# Altium schematic sheet [03] - WIRELESS MCU,CONTROLS.SchDoc
size A3; DocumentNumber: 3; SheetNumber: 3; SheetTotal: 8
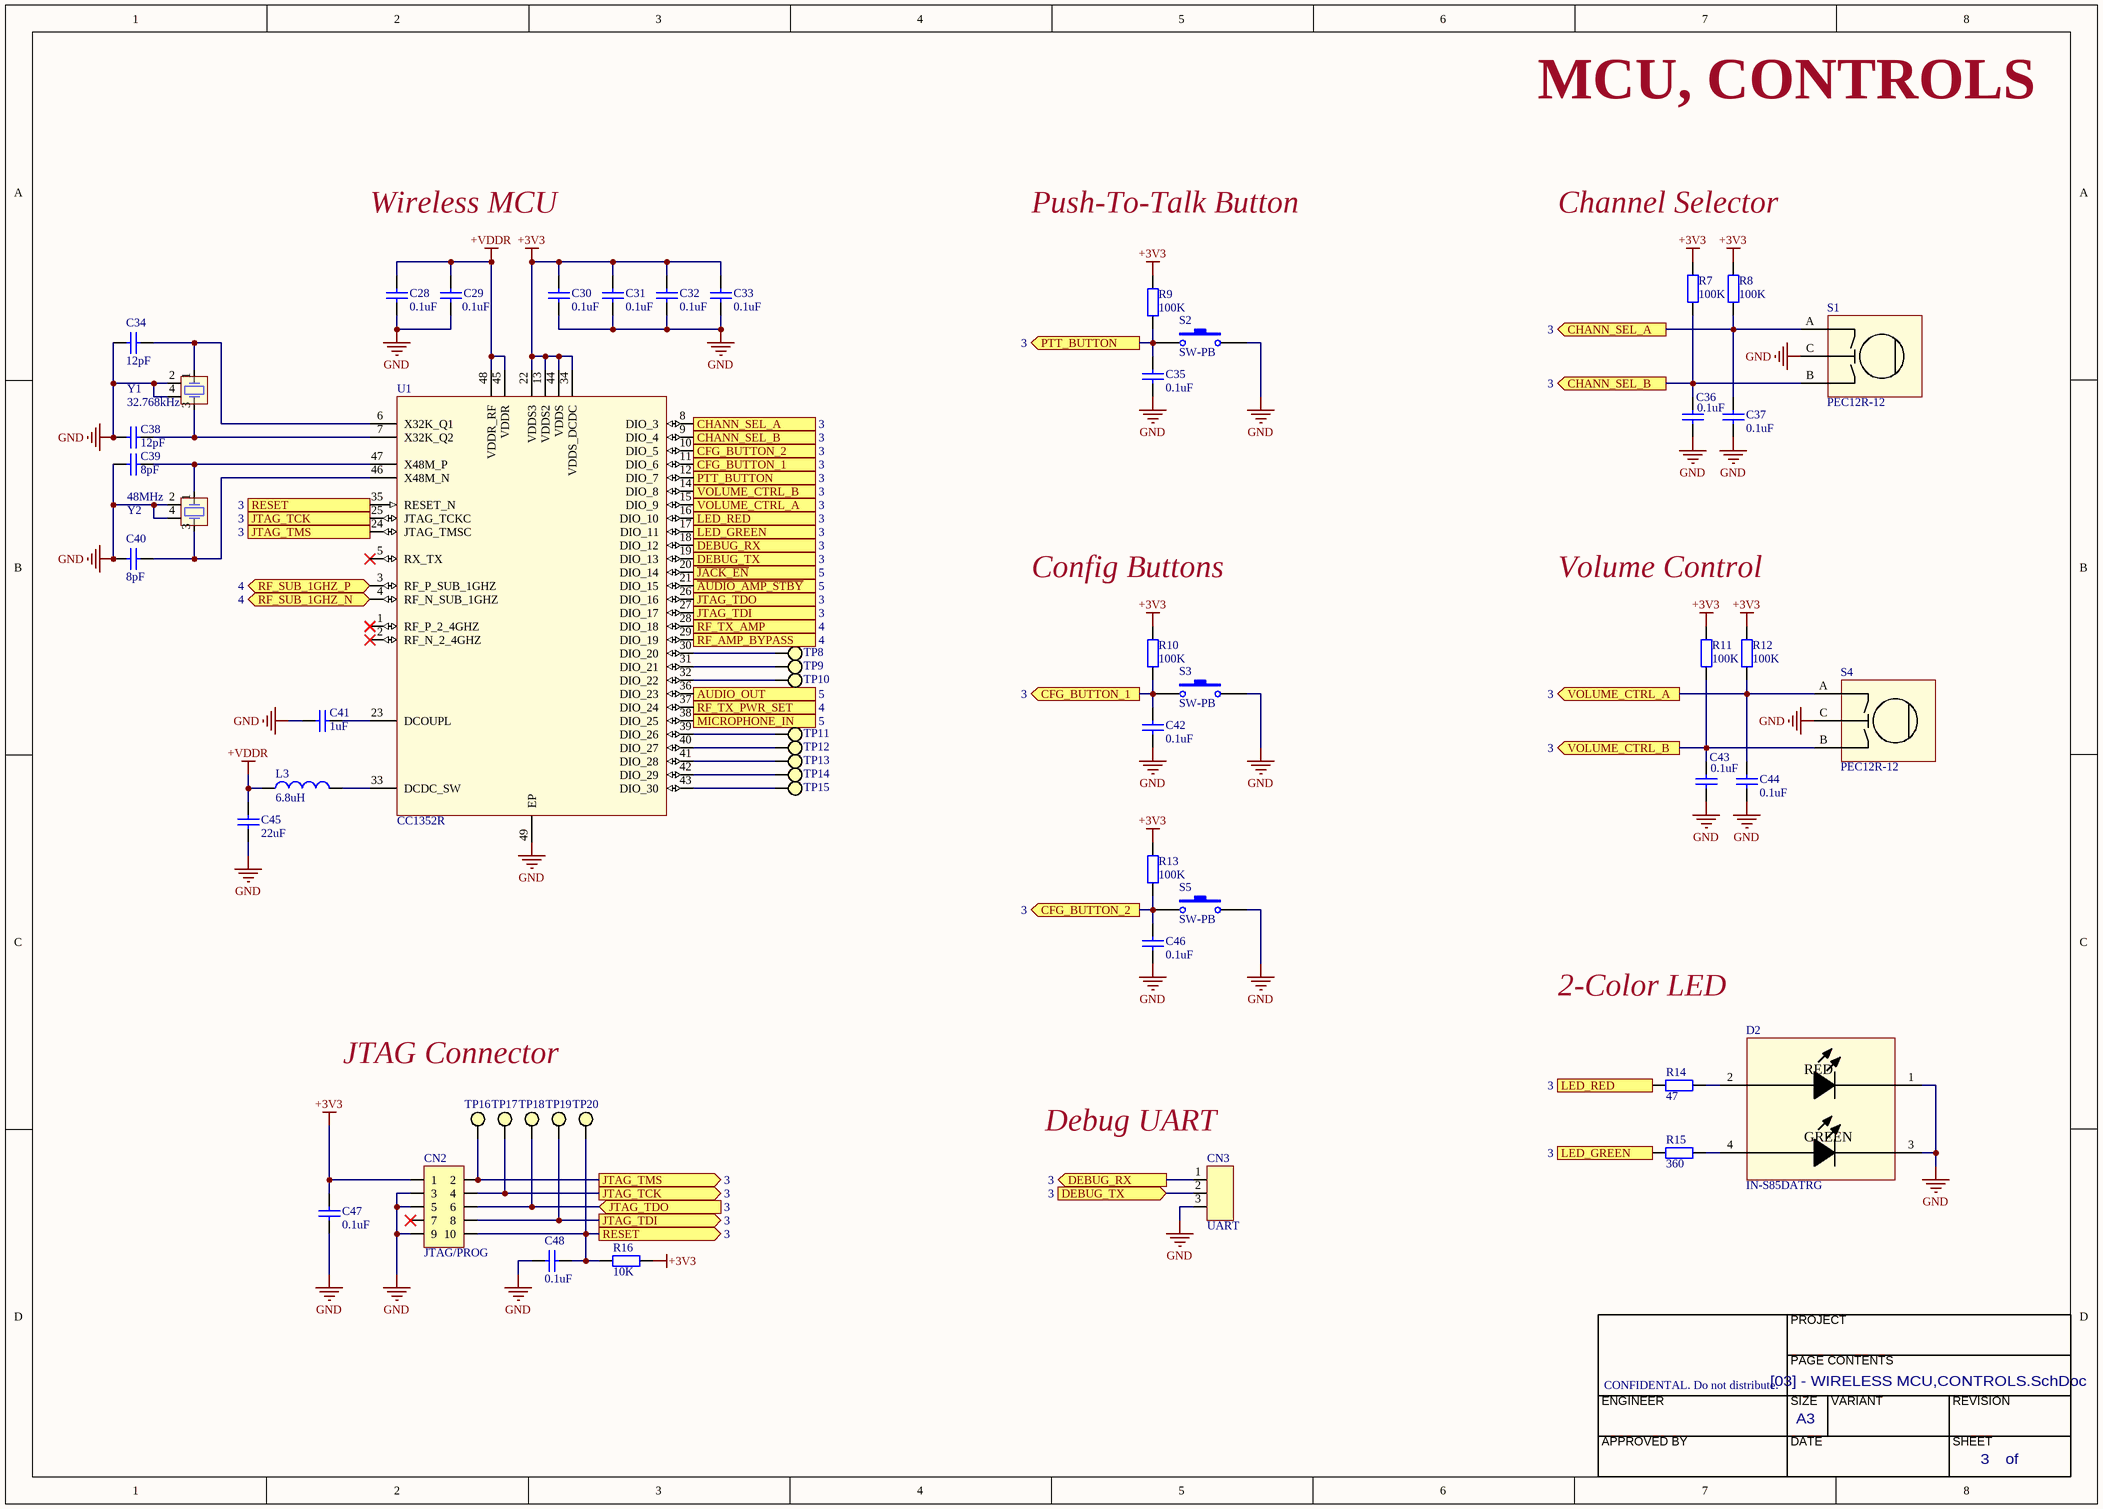
[diagram p0: [03] - WIRELESS MCU,CONTROLS.SchDoc]

## Parts
C28  0.1uF  [CAP0603]
C29  0.1uF  [CAP0603]
C30  0.1uF  [CAP0603]
C31  0.1uF  [CAP0603]
C32  0.1uF  [CAP0603]
C33  0.1uF  [CAP0603]
C34  12pF  [CAP0603]
C35  0.1uF  [CAP0603]
C36  0.1uF  [CAP0603]
C37  0.1uF  [CAP0603]
C38  12pF  [CAP0603]
C39  8pF  [CAP0603]
C40  8pF  [CAP0603]
C41  1uF  [CAP0603]
C42  0.1uF  [CAP0603]
C43  0.1uF  [CAP0603]
C44  0.1uF  [CAP0603]
C45  22uF  [CAP0603]
C46  0.1uF  [CAP0603]
C47  0.1uF  [CAP0603]
C48  0.1uF  [CAP0603]
CN2  JTAG/PROG  [CONN_3220-10-0100-00]
CN3  UART  [H-D-1x3]
D2  IN-S85DATRG  [INS128DATRG]
L3  6.8uH  [INDC0603-0201]
R7  100K  [RES0603]
R8  100K  [RES0603]
R9  100K  [RES0603]
R10  100K  [RES0603]
R11  100K  [RES0603]
R12  100K  [RES0603]
R13  100K  [RES0603]
R14  47  [RES0603]
R15  360  [RES0603]
R16  10K  [RES0603]
S1  PEC12R-12
S2  SW-PB  [ButtonSmall]
S3  SW-PB  [ButtonSmall]
S4  PEC12R-12
S5  SW-PB  [ButtonSmall]
TP8  TestPoint  [TestPoint]  (value not drawn)  (no BOM)
TP9  TestPoint  [TestPoint]  (value not drawn)  (no BOM)
TP10  TestPoint  [TestPoint]  (value not drawn)  (no BOM)
TP11  TestPoint  [TestPoint]  (value not drawn)  (no BOM)
TP12  TestPoint  [TestPoint]  (value not drawn)  (no BOM)
TP13  TestPoint  [TestPoint]  (value not drawn)  (no BOM)
TP14  TestPoint  [TestPoint]  (value not drawn)  (no BOM)
TP15  TestPoint  [TestPoint]  (value not drawn)  (no BOM)
TP16  TestPoint  [TestPoint]  (value not drawn)  (no BOM)
TP17  TestPoint  [TestPoint]  (value not drawn)  (no BOM)
TP18  TestPoint  [TestPoint]  (value not drawn)  (no BOM)
TP19  TestPoint  [TestPoint]  (value not drawn)  (no BOM)
TP20  TestPoint  [TestPoint]  (value not drawn)  (no BOM)
U1  CC1352R  [RGZ0048A]
Y1  32.768kHz  [ABM3B]
Y2  48MHz  [ABM3B]

## Ports
AUDIO_OUT (out, see 5), CFG_BUTTON_1 (in, see 3), CFG_BUTTON_1 (out, see 3), CFG_BUTTON_2 (in, see 3), CFG_BUTTON_2 (out, see 3), CHANN_SEL_A (in, see 3), CHANN_SEL_A (out, see 3), CHANN_SEL_B (in, see 3), CHANN_SEL_B (out, see 3), DEBUG_RX (in, see 3), DEBUG_RX (out, see 3), DEBUG_TX (in, see 3), DEBUG_TX (out, see 3), JTAG_TCK (in, see 3), JTAG_TCK (out, see 3), JTAG_TDI (in, see 3), JTAG_TDI (out, see 3), JTAG_TDO (in, see 3), JTAG_TDO (out, see 3), JTAG_TMS (in, see 3), JTAG_TMS (out, see 3), LED_GREEN (in, see 3), LED_GREEN (out, see 3), LED_RED (in, see 3), LED_RED (out, see 3), MICROPHONE_IN (in, see 5), PTT_BUTTON (in, see 3), PTT_BUTTON (out, see 3), RESET (in, see 3), RESET (out, see 3), RF_AMP_BYPASS (out, see 4), RF_SUB_1GHZ_N (bidir, see 4), RF_SUB_1GHZ_P (bidir, see 4), RF_TX_AMP (out, see 4), RF_TX_PWR_SET (out, see 4), VOLUME_CTRL_A (in, see 3), VOLUME_CTRL_A (out, see 3), VOLUME_CTRL_B (in, see 3), VOLUME_CTRL_B (out, see 3), ~{AUDIO_AMP_STBY} (out, see 5), ~{JACK_EN} (in, see 5)

## Nets
+3V3: C30.1 C31.1 C32.1 C33.1 C47.2 CN2.1 R7.1 R8.2 R9.1 R10.1 R11.1 R12.2 R13.1 R16.2 U1.13(VDDS2) U1.22(VDDS3) U1.34(VDDS_DCDC) U1.44(VDDS)
+VDDR: C28.1 C29.1 C45.2 L3.1 U1.45(VDDR) U1.48(VDDR_RF)
GND: C28.2 C29.2 C30.2 C31.2 C32.2 C33.2 C34.1 C35.1 C36.1 C37.1 C38.1 C39.1 C40.1 C41.2 C42.1 C43.1 C44.1 C45.1 C46.1 C47.1 C48.1 CN2.3 CN2.5 CN2.9 CN3.3 D2.1(C_R) D2.3(C_G) S1.C S2.2 S3.2 S4.C S5.2 U1.49(EP) Y1.2(GND) Y1.4(GND) Y2.2(GND) Y2.4(GND)
~{AUDIO_AMP_STBY}: U1.21(DIO_15) ; port ~{AUDIO_AMP_STBY}
AUDIO_OUT: U1.36(DIO_23) ; port AUDIO_OUT
CFG_BUTTON_1: C42.2 R10.2 S3.1 U1.11(DIO_6) ; port CFG_BUTTON_1
CFG_BUTTON_2: C46.2 R13.2 S5.1 U1.10(DIO_5) ; port CFG_BUTTON_2
CHANN_SEL_A: C37.2 R8.1 S1.A U1.8(DIO_3) ; port CHANN_SEL_A
CHANN_SEL_B: C36.2 R7.2 S1.B U1.9(DIO_4) ; port CHANN_SEL_B
DEBUG_RX: CN3.1 U1.18(DIO_12) ; port DEBUG_RX
DEBUG_TX: CN3.2 U1.19(DIO_13) ; port DEBUG_TX
~{JACK_EN}: U1.20(DIO_14) ; port ~{JACK_EN}
JTAG_TCK: CN2.4 TP17.1 U1.25(JTAG_TCKC) ; port JTAG_TCK
JTAG_TDI: CN2.8 TP19.1 U1.27(DIO_17) ; port JTAG_TDI
JTAG_TDO: CN2.6 TP18.1 U1.26(DIO_16) ; port JTAG_TDO
JTAG_TMS: CN2.2 TP16.1 U1.24(JTAG_TMSC) ; port JTAG_TMS
LED_GREEN: R15.2 U1.17(DIO_11) ; port LED_GREEN
LED_RED: R14.1 U1.16(DIO_10) ; port LED_RED
MICROPHONE_IN: U1.38(DIO_25) ; port MICROPHONE_IN
PTT_BUTTON: C35.2 R9.2 S2.1 U1.12(DIO_7) ; port PTT_BUTTON
RESET: C48.2 CN2.10 R16.1 TP20.1 U1.35(RESET_N) ; port RESET
RF_AMP_BYPASS: U1.29(DIO_19) ; port RF_AMP_BYPASS
RF_SUB_1GHZ_N: U1.4(RF_N_SUB_1GHZ) ; port RF_SUB_1GHZ_N
RF_SUB_1GHZ_P: U1.3(RF_P_SUB_1GHZ) ; port RF_SUB_1GHZ_P
RF_TX_AMP: U1.28(DIO_18) ; port RF_TX_AMP
RF_TX_PWR_SET: U1.37(DIO_24) ; port RF_TX_PWR_SET
VOLUME_CTRL_A: C44.2 R12.1 S4.A U1.15(DIO_9) ; port VOLUME_CTRL_A
VOLUME_CTRL_B: C43.2 R11.2 S4.B U1.14(DIO_8) ; port VOLUME_CTRL_B
NetC34_2: C34.2 U1.6(X32K_Q1) Y1.1(OSC1)
NetC38_2: C38.2 U1.7(X32K_Q2) Y1.3(OSC2)
NetC39_2: C39.2 U1.47(X48M_P) Y2.1(OSC1)
NetC40_2: C40.2 U1.46(X48M_N) Y2.3(OSC2)
NetC41_1: C41.1 U1.23(DCOUPL)
NetD2_2: D2.2(A_R) R14.2
NetD2_4: D2.4(A_G) R15.1
NetL3_2: L3.2 U1.33(DCDC_SW)
NetTP8_1: TP8.1 U1.30(DIO_20)
NetTP9_1: TP9.1 U1.31(DIO_21)
NetTP10_1: TP10.1 U1.32(DIO_22)
NetTP11_1: TP11.1 U1.39(DIO_26)
NetTP12_1: TP12.1 U1.40(DIO_27)
NetTP13_1: TP13.1 U1.41(DIO_28)
NetTP14_1: TP14.1 U1.42(DIO_29)
NetTP15_1: TP15.1 U1.43(DIO_30)

Not connected (* = marked no-connect by the designer): CN2 7*; U1 1(RF_P_2_4GHZ)* 2(RF_N_2_4GHZ)* 5(RX_TX)*

## Notes on the sheet
- MCU, CONTROLS
- Wireless MCU
- Push-To-Talk Button
- Channel Selector
- Config Buttons
- Volume Control
- 2-Color LED
- JTAG Connector
- (near CN3) Debug UART
- PROJECT
- CONFIDENTAL. Do not distribute.
- PAGE CONTENTS
- ENGINEER
- APPROVED BY
- SIZE
- DATE
- A3
- VARIANT
- REVISION
- SHEET
- of
- (in symbol IN-S85DATRG) RED; GREEN

## Library data of the parts
C28-C33 = Cap: Capacitor; Manufacturer: KEMET; Manufacturer Part Number: C0603C104M5RACTU; Description 1: Cap Ceramic 0.1uF 50V X7R 20% SMD 0603 125C T/R; Dielectric Material: Ceramic; Capacitance: 100nF; Tolerance: 20%; Voltage Rating: 50V; Dielectric: X7R; Dissipation Factor: 2.5%; ComponentLink1URL: https://datasheet.ciiva.com/5999/1732731-5999390.pdf?src-supplier=Farnell; ComponentLink1Description: https://datasheet.ciiva.com/5999/1732731-5999390.pdf?src-supplier=Farnell; ComponentLink2URL: https://datasheet.ciiva.com/28645/1851736-28645613.pdf?src-supplier=Element14; ComponentLink2Description: https://datasheet.ciiva.com/28645/1851736-28645613.pdf?src-supplier=Element14; ComponentLink3URL: https://datasheet.ciiva.com/7823/kem-c1002-x7r-smd-7823982.pdf?src-supplier=Element14; ComponentLink3Description: https://datasheet.ciiva.com/7823/kem-c1002-x7r-smd-7823982.pdf?src-supplier=Element14; ComponentLink4URL: http://datasheet.octopart.com/C0603C104J4RACTU-KEMET-datasheet-137357764.pdf?src-supplier=Upverter; ComponentLink4Description: http://datasheet.octopart.com/C0603C104J4RACTU-KEMET-datasheet-137357764.pdf?src-supplier=Upverter; ComponentLink5URL: http://datasheet.octopart.com/C0603C104J4RAC-TU-Kemet-datasheet-5313890.pdf?src-supplier=Farnell; ComponentLink5Description: http://datasheet.octopart.com/C0603C104J4RAC-TU-Kemet-datasheet-5313890.pdf?src-supplier=Farnell; ComponentLink6URL: http://datasheet.octopart.com/C0603C104J4RACTU-Kemet-datasheet-10404442.pdf?src-supplier=Farnell; ComponentLink6Description: http://datasheet.octopart.com/C0603C104J4RACTU-Kemet-datasheet-10404442.pdf?src-supplier=Farnell; ComponentLink7URL: http://datasheet.octopart.com/C0603C104J4RACTU-Kemet-datasheet-10942409.pdf?src-supplier=Farnell; ComponentLink7Description: http://datasheet.octopart.com/C0603C104J4RACTU-Kemet-datasheet-10942409.pdf?src-supplier=Farnell; ComponentLink8URL: http://datasheet.octopart.com/C0603C104J4RACTU-Kemet-datasheet-11992184.pdf?src-supplier=Farnell; ComponentLink8Description: http://datasheet.octopart.com/C0603C104J4RACTU-Kemet-datasheet-11992184.pdf?src-supplier=Farnell; ComponentLink9URL: http://datasheet.octopart.com/C0603C104J4RACTU-Kemet-datasheet-12608295.pdf?src-supplier=Farnell; ComponentLink9Description: http://datasheet.octopart.com/C0603C104J4RACTU-Kemet-datasheet-12608295.pdf?src-supplier=Farnell; ComponentLink10URL: http://datasheet.octopart.com/C0603C104J4RACTU-KEMET-datasheet-101575649.pdf?src-supplier=Farnell; ComponentLink10Description: http://datasheet.octopart.com/C0603C104J4RACTU-KEMET-datasheet-101575649.pdf?src-supplier=Farnell; ComponentLink11URL: http://datasheet.octopart.com/C0603C104J4RACTU-Kemet-datasheet-464.pdf?src-supplier=Allied+Electronics; ComponentLink11Description: http://datasheet.octopart.com/C0603C104J4RACTU-Kemet-datasheet-464.pdf?src-supplier=Allied+Electronics; ComponentLink12URL: http://datasheet.octopart.com/C0603C104J4RAC-TU-Kemet-datasheet-8216256.pdf?src-supplier=Jameco; ComponentLink12Description: http://datasheet.octopart.com/C0603C104J4RAC-TU-Kemet-datasheet-8216256.pdf?src-supplier=Jameco; ComponentLink13URL: http://datasheet.octopart.com/C0603C104J4RAC-TU-Kemet-datasheet-5313836.pdf?src-supplier=Farnell; ComponentLink13Description: http://datasheet.octopart.com/C0603C104J4RAC-TU-Kemet-datasheet-5313836.pdf?src-supplier=Farnell; ComponentLink14URL: http://datasheet.octopart.com/C0603C104J4RAC-TU-Kemet-datasheet-5314449.pdf?src-supplier=Farnell; ComponentLink14Description: http://datasheet.octopart.com/C0603C104J4RAC-TU-Kemet-datasheet-5314449.pdf?src-supplier=Farnell; ComponentLink15URL: http://datasheet.octopart.com/C0603C104J4RAC-TU-Kemet-datasheet-5314627.pdf?src-supplier=Farnell; ComponentLink15Description: http://datasheet.octopart.com/C0603C104J4RAC-TU-Kemet-datasheet-5314627.pdf?src-supplier=Farnell; ComponentLink16URL: http://datasheet.octopart.com/C0603C104J4RAC-TU-Kemet-datasheet-5314837.pdf?src-supplier=Farnell; ComponentLink16Description: http://datasheet.octopart.com/C0603C104J4RAC-TU-Kemet-datasheet-5314837.pdf?src-supplier=Farnell; ComponentLink17URL: http://datasheet.octopart.com/C0603C104J4RAC-TU-Kemet-datasheet-5314969.pdf?src-supplier=Farnell; ComponentLink17Description: http://datasheet.octopart.com/C0603C104J4RAC-TU-Kemet-datasheet-5314969.pdf?src-supplier=Farnell; ComponentLink18URL: http://datasheet.octopart.com/C0603C104J4RAC-TU-Kemet-datasheet-5315946.pdf?src-supplier=Farnell; ComponentLink18Description: http://datasheet.octopart.com/C0603C104J4RAC-TU-Kemet-datasheet-5315946.pdf?src-supplier=Farnell; ComponentLink19URL: http://datasheet.octopart.com/C0603C104J4RAC-TU-Kemet-datasheet-5316294.pdf?src-supplier=Farnell; ComponentLink19Description: http://datasheet.octopart.com/C0603C104J4RAC-TU-Kemet-datasheet-5316294.pdf?src-supplier=Farnell; ComponentLink20URL: http://datasheet.octopart.com/C0603C104J4RAC-TU-Kemet-datasheet-5389132.pdf?src-supplier=Farnell; ComponentLink20Description: http://datasheet.octopart.com/C0603C104J4RAC-TU-Kemet-datasheet-5389132.pdf?src-supplier=Farnell; ComponentLink21URL: http://datasheet.octopart.com/C0603C104J4RAC-TU-Kemet-datasheet-5390537.pdf?src-supplier=Farnell; ComponentLink21Description: http://datasheet.octopart.com/C0603C104J4RAC-TU-Kemet-datasheet-5390537.pdf?src-supplier=Farnell; ComponentLink22URL: http://datasheet.octopart.com/C0603C104J4RAC-TU-Kemet-datasheet-7541751.pdf?src-supplier=Farnell; ComponentLink22Description: http://datasheet.octopart.com/C0603C104J4RAC-TU-Kemet-datasheet-7541751.pdf?src-supplier=Farnell; ComponentLink23URL: http://datasheet.octopart.com/C0603C104J4RAC-TU-Kemet-datasheet-7601896.pdf?src-supplier=Farnell; ComponentLink23Description: http://datasheet.octopart.com/C0603C104J4RAC-TU-Kemet-datasheet-7601896.pdf?src-supplier=Farnell; ComponentLink24URL: http://datasheet.octopart.com/C0603C104J4RAC-TU-Kemet-datasheet-7627733.pdf?src-supplier=Farnell; ComponentLink24Description: http://datasheet.octopart.com/C0603C104J4RAC-TU-Kemet-datasheet-7627733.pdf?src-supplier=Farnell; ComponentLink25URL: http://datasheet.octopart.com/C0603C104J4RAC-TU-Kemet-datasheet-7833651.pdf?src-supplier=Farnell; ComponentLink25Description: http://datasheet.octopart.com/C0603C104J4RAC-TU-Kemet-datasheet-7833651.pdf?src-supplier=Farnell; ComponentLink26URL: http://datasheet.octopart.com/C0603C104J4RAC-TU-Kemet-datasheet-8092359.pdf?src-supplier=Farnell; ComponentLink26Description: http://datasheet.octopart.com/C0603C104J4RAC-TU-Kemet-datasheet-8092359.pdf?src-supplier=Farnell; ComponentLink27URL: http://datasheet.octopart.com/C0603C104J4RAC-TU-Kemet-datasheet-8111010.pdf?src-supplier=Farnell; ComponentLink27Description: http://datasheet.octopart.com/C0603C104J4RAC-TU-Kemet-datasheet-8111010.pdf?src-supplier=Farnell; ComponentLink28URL: http://datasheet.octopart.com/C0603C104J4RACTU-Kemet-datasheet-22084244.pdf?src-supplier=Element14; ComponentLink28Description: http://datasheet.octopart.com/C0603C104J4RACTU-Kemet-datasheet-22084244.pdf?src-supplier=Element14; ComponentLink29URL: http://datasheet.octopart.com/C0603C104J4RACTU-Kemet-datasheet-21389237.pdf?src-supplier=Element14; ComponentLink29Description: http://datasheet.octopart.com/C0603C104J4RACTU-Kemet-datasheet-21389237.pdf?src-supplier=Element14; ComponentLink30URL: http://datasheet.octopart.com/C0603C104J4RACTU-Kemet-datasheet-24570007.pdf?src-supplier=Element14; ComponentLink30Description: http://datasheet.octopart.com/C0603C104J4RACTU-Kemet-datasheet-24570007.pdf?src-supplier=Element14; ComponentLink31URL: http://datasheet.octopart.com/C0603C104J4RACTU-Kemet-datasheet-27203261.pdf?src-supplier=Newark; ComponentLink31Description: http://datasheet.octopart.com/C0603C104J4RACTU-Kemet-datasheet-27203261.pdf?src-supplier=Newark; ComponentLink32URL: http://datasheet.octopart.com/C0603C104J4RACTU-Kemet-datasheet-67830779.pdf?src-supplier=TME; ComponentLink32Description: http://datasheet.octopart.com/C0603C104J4RACTU-Kemet-datasheet-67830779.pdf?src-supplier=TME; ComponentLink33URL: http://datasheet.octopart.com/C0603C104J4RACTU-KEMET-datasheet-84169754.pdf; ComponentLink33Description: http://datasheet.octopart.com/C0603C104J4RACTU-KEMET-datasheet-84169754.pdf; ComponentLink34URL: http://datasheet.octopart.com/C0603C104J4RACTU-KEMET-datasheet-110724412.pdf?src-supplier=Allied+Electronics; ComponentLink34Description: http://datasheet.octopart.com/C0603C104J4RACTU-KEMET-datasheet-110724412.pdf?src-supplier=Allied+Electronics; ComponentLink35URL: http://datasheet.octopart.com/C0603C104J4RACTU-KEMET-datasheet-68331906.pdf?src-supplier=TME; ComponentLink35Description: http://datasheet.octopart.com/C0603C104J4RACTU-KEMET-datasheet-68331906.pdf?src-supplier=TME; Supplier 1: Digi-Key; Supplier Part Number 1: 399-7845-1-ND; Stock: 899636; Pricing 1: 1=0.10000, 10=0.03700, 50=0.02040, 100=0.01660, 500=0.01186, 1000=0.00932 (USD); RoHS: Yes; Mount: Surface Mount,PCB; Case/Package: 0603; Case Code (Metric): 1608; Case Code (Imperial): 0603; Contact Plating: Tin,Matte; Min Operating Temperature: -55°C; Max Operating Temperature: 125°C; Package Quantity: 1; Packaging: Tape and Reel; Voltage Rating (DC): 50V; Termination: SMD/SMT; Length: 1.6mm; Height: 0.8mm; Width: 0.031inch; Thickness: 0.034inch; Lead Pitch: 0.7mm; Depth: 0.8mm; Radiation Hardening: No; REACH SVHC: No SVHC; ComponentLink36URL: http://www.alliedelec.com/m/d/6f3b5eb83d09db50ed28bdc730567b33.pdf?src-supplier=Allied+Electronics; ComponentLink36Description: http://www.alliedelec.com/m/d/6f3b5eb83d09db50ed28bdc730567b33.pdf?src-supplier=Allied+Electronics; ComponentLink37URL: http://www.mouser.com/ds/2/212/KEM_C1002_X7R_SMD-1102033.pdf?src-supplier=Mouser; ComponentLink37Description: http://www.mouser.com/ds/2/212/KEM_C1002_X7R_SMD-1102033.pdf?src-supplier=Mouser; ComponentLink38URL: https://www.verical.com/server-webapp/html/getDatasheet?partID=626892&src-supplier=Verical; ComponentLink38Description: https://www.verical.com/server-webapp/html/getDatasheet?partID=626892&src-supplier=Verical; ComponentLink39URL: http://www.farnell.com/datasheets/2746056.pdf?src-supplier=Farnell; ComponentLink39Description: http://www.farnell.com/datasheets/2746056.pdf?src-supplier=Farnell; ComponentLink40URL: http://components.arrow.com/part/dataview/0323_00313986?src-supplier=Arrow+Europe; ComponentLink40Description: http://components.arrow.com/part/dataview/0323_00313986?src-supplier=Arrow+Europe; ComponentLink41URL: http://components.arrow.com/part/dataview/40911037S8853915N7429?src-supplier=Arrow; ComponentLink41Description: http://components.arrow.com/part/dataview/40911037S8853915N7429?src-supplier=Arrow; ComponentLink42URL: http://capacitoredge.kemet.com/capedge2/DataSheet?pn=C0603C104M5RAC7867&src-supplier=Avnet; ComponentLink42Description: http://capacitoredge.kemet.com/capedge2/DataSheet?pn=C0603C104M5RAC7867&src-supplier=Avnet; ComponentLink43URL: http://capacitoredge.kemet.com/capedge2/DataSheet?pn=C0603C104M5RAC7867&src-supplier=Avnet+Asia; ComponentLink43Description: http://capacitoredge.kemet.com/capedge2/DataSheet?pn=C0603C104M5RAC7867&src-supplier=Avnet+Asia; ComponentLink44URL: http://www.farnell.com/datasheets/2746056.pdf?src-supplier=Element14; ComponentLink44Description: http://www.farnell.com/datasheets/2746056.pdf?src-supplier=Element14; ComponentLink45URL: https://api.kemet.com/component-edge/download/datasheet/C0603C104M5RACTU.pdf?src-supplier=Digi-Key; ComponentLink45Description: https://api.kemet.com/component-edge/download/datasheet/C0603C104M5RACTU.pdf?src-supplier=Digi-Key; ComponentLink46URL: http://www.farnell.com/datasheets/2315113.pdf?src-supplier=Newark; ComponentLink46Description: http://www.farnell.com/datasheets/2315113.pdf?src-supplier=Newark; ComponentLink47URL: http://www.farnell.com/datasheets/1828800.pdf?src-supplier=Newark; ComponentLink47Description: http://www.farnell.com/datasheets/1828800.pdf?src-supplier=Newark; ComponentLink48URL: http://www.farnell.com/datasheets/2746056.pdf?src-supplier=Newark; ComponentLink48Description: http://www.farnell.com/datasheets/2746056.pdf?src-supplier=Newark; ComponentLink49URL: https://www.verical.com/server-webapp/html/getDatasheet?partID=110138&src-supplier=Verical; ComponentLink49Description: https://www.verical.com/server-webapp/html/getDatasheet?partID=110138&src-supplier=Verical
C34-C46 C48 = cap: Multilayer Ceramic Capacitors MLCC - SMD/SMT 50V .1uF X7R 0603 10% Tol; Manufacturer: TDK; Manufacturer Part Number: CGA3E2X5R1H104K080AA; Description 2: CAP CER 0.1UF 100V X7S 0603; Description 1: CAP CER 0.1UF 50V X5R 0603; Capacitance: 100nF; Dielectric: X5R; ComponentLink1URL: https://datasheet.ciiva.com/24216/cga3e2x7r1h102k080aa-265935-24216863.pdf?src-supplier=Mouser; ComponentLink1Description: https://datasheet.ciiva.com/24216/cga3e2x7r1h102k080aa-265935-24216863.pdf?src-supplier=Mouser; ComponentLink2URL: https://datasheet.ciiva.com/46424/1839935-46424223.pdf?src-supplier=Element14; ComponentLink2Description: https://datasheet.ciiva.com/46424/1839935-46424223.pdf?src-supplier=Element14; Features: Soft Termination; Ratings: AEC-Q200; ComponentLink3URL: http://www.mouser.com/ds/2/40/AutoMLCC-777028.pdf?src-supplier=Mouser; ComponentLink3Description: http://www.mouser.com/ds/2/40/AutoMLCC-777028.pdf?src-supplier=Mouser; ComponentLink4URL: http://components.arrow.com/part/dataview/0323_03442275?src-supplier=Arrow+Europe; ComponentLink4Description: http://components.arrow.com/part/dataview/0323_03442275?src-supplier=Arrow+Europe; ComponentLink5URL: http://catalogs.avx.com/SurfaceMount.pdf?src-supplier=Digi-Key; ComponentLink5Description: http://catalogs.avx.com/SurfaceMount.pdf?src-supplier=Digi-Key; ComponentLink6URL: http://www.avx.com/docs/Catalogs/flexiterm.pdf?src-supplier=Future+Electronics; ComponentLink6Description: http://www.avx.com/docs/Catalogs/flexiterm.pdf?src-supplier=Future+Electronics; ComponentLink7URL: https://www.avx.com/docs/Catalogs/flexiterm.pdf?src-supplier=Avnet; ComponentLink7Description: https://www.avx.com/docs/Catalogs/flexiterm.pdf?src-supplier=Avnet; Supplier 2: Digi-Key; Supplier Part Number 2: 445-5202-1-ND; Stock 2: 75283; Pricing 2: 1=0,21000, 10=0,14900, 50=0,08460, 100=0,07000, 500=0,04910, 1000=0,04065 (USD); ComponentLink8URL: https://datasheet.ciiva.com/24219/c1608x7s2a104m080ab-264673-24219216.pdf?src-supplier=Mouser; ComponentLink8Description: https://datasheet.ciiva.com/24219/c1608x7s2a104m080ab-264673-24219216.pdf?src-supplier=Mouser; ComponentLink9URL: https://datasheet.ciiva.com/26919/getdatasheetpartid-756132-26919198.pdf?src-supplier=Verical; ComponentLink9Description: https://datasheet.ciiva.com/26919/getdatasheetpartid-756132-26919198.pdf?src-supplier=Verical; Supplier 1: Digi-Key; Supplier Part Number 1: 445-12498-1-ND; RoHS: Yes; Category: Ceramic Capacitors; Stock 1: 20972; Pricing 1: 1=0,10000, 10=0,07300, 50=0,03960, 100=0,03230, 500=0,02310, 1000=0,01815 (USD); Mount: Surface Mount; Case/Package: 0603; Case Code (Metric): 1608; Case Code (Imperial): 0603; Weight: 7.1E-05oz; Min Operating Temperature: -55°C; Max Operating Temperature: 85°C; Package Quantity: 4000; Packaging: Tape and Reel; Tolerance: 10%; Voltage Rating: 50V; Termination: SMD/SMT; Voltage Rating (DC): 50V; Series: CGA; Length: 0.063inch; Width: 0.8mm; Height: 0.8mm; Thickness: 0.035inch; RoHS Compliant: Yes; ComponentLink10URL: http://www.mouser.com/ds/2/400/lcc_automotive_general_en-843974.pdf?src-supplier=Mouser; ComponentLink10Description: http://www.mouser.com/ds/2/400/lcc_automotive_general_en-843974.pdf?src-supplier=Mouser; ComponentLink11URL: https://product.tdk.com/info/en/documents/chara_sheet/CGA3E2X5R1H104K080AA.pdf?src-supplier=Digi-Key; ComponentLink11Description: https://product.tdk.com/info/en/documents/chara_sheet/CGA3E2X5R1H104K080AA.pdf?src-supplier=Digi-Key; ComponentLink12URL: http://product.tdk.com/en/catalog/datasheets/mlcc_automotive_general_en.pdf?src-supplier=Avnet; ComponentLink12Description: http://product.tdk.com/en/catalog/datasheets/mlcc_automotive_general_en.pdf?src-supplier=Avnet; ComponentLink13URL: https://product.tdk.com/info/en/catalog/datasheets/mlcc_automotive_general_en.pdf?src-supplier=Digi-Key; ComponentLink13Description: https://product.tdk.com/info/en/catalog/datasheets/mlcc_automotive_general_en.pdf?src-supplier=Digi-Key
C47 = cap: Manufacturer: TDK; Manufacturer Part Number: CGA3E2X5R1H104K080AA; Description 1: CAP CER 0.1UF 50V X5R 0603; Capacitance: 100nF; Tolerance: 10%; Voltage Rating: 50V; Dielectric: X5R; ComponentLink1URL: https://datasheet.ciiva.com/24216/cga3e2x7r1h102k080aa-265935-24216863.pdf?src-supplier=Mouser; ComponentLink1Description: https://datasheet.ciiva.com/24216/cga3e2x7r1h102k080aa-265935-24216863.pdf?src-supplier=Mouser; ComponentLink2URL: https://datasheet.ciiva.com/46424/1839935-46424223.pdf?src-supplier=Element14; ComponentLink2Description: https://datasheet.ciiva.com/46424/1839935-46424223.pdf?src-supplier=Element14; ComponentLink3URL: https://datasheet.ciiva.com/24219/c1608x7s2a104m080ab-264673-24219216.pdf?src-supplier=Mouser; ComponentLink3Description: https://datasheet.ciiva.com/24219/c1608x7s2a104m080ab-264673-24219216.pdf?src-supplier=Mouser; ComponentLink4URL: https://datasheet.ciiva.com/26919/getdatasheetpartid-756132-26919198.pdf?src-supplier=Verical; ComponentLink4Description: https://datasheet.ciiva.com/26919/getdatasheetpartid-756132-26919198.pdf?src-supplier=Verical; Supplier 1: Digi-Key; Supplier Part Number 1: 445-12498-1-ND; RoHS: Yes; Category: Ceramic Capacitors; Stock 1: 20972; Pricing 1: 1=0,10000, 10=0,07300, 50=0,03960, 100=0,03230, 500=0,02310, 1000=0,01815 (USD); Mount: Surface Mount; Case/Package: 0603; Case Code (Metric): 1608; Case Code (Imperial): 0603; Weight: 7.1E-05oz; Min Operating Temperature: -55°C; Max Operating Temperature: 85°C; Package Quantity: 4000; Packaging: Tape and Reel; Termination: SMD/SMT; Voltage Rating (DC): 50V; Series: CGA; Length: 0.063inch; Width: 0.8mm; Height: 0.8mm; Thickness: 0.035inch; Ratings: AEC-Q200; RoHS Compliant: Yes; ComponentLink5URL: http://www.mouser.com/ds/2/400/lcc_automotive_general_en-843974.pdf?src-supplier=Mouser; ComponentLink5Description: http://www.mouser.com/ds/2/400/lcc_automotive_general_en-843974.pdf?src-supplier=Mouser; ComponentLink6URL: https://product.tdk.com/info/en/documents/chara_sheet/CGA3E2X5R1H104K080AA.pdf?src-supplier=Digi-Key; ComponentLink6Description: https://product.tdk.com/info/en/documents/chara_sheet/CGA3E2X5R1H104K080AA.pdf?src-supplier=Digi-Key; ComponentLink7URL: http://product.tdk.com/en/catalog/datasheets/mlcc_automotive_general_en.pdf?src-supplier=Avnet; ComponentLink7Description: http://product.tdk.com/en/catalog/datasheets/mlcc_automotive_general_en.pdf?src-supplier=Avnet; ComponentLink8URL: https://product.tdk.com/info/en/catalog/datasheets/mlcc_automotive_general_en.pdf?src-supplier=Digi-Key; ComponentLink8Description: https://product.tdk.com/info/en/catalog/datasheets/mlcc_automotive_general_en.pdf?src-supplier=Digi-Key
CN2 = SWD/PROG: Manufacturer: AMPHENOL ICC (FCI); Manufacturer Part Number: 20021511-00010T4LF; Description 1: Conn Shrouded Header (4 Sides) HDR 10 POS 1.27mm Solder ST Thru-Hole Tube; Supplier 1: Digi-Key; Supplier Part Number 1: 609-5420-ND; RoHS: No; Stock 1: 299; Pricing 1: 1=1,40000, 22=1,22818, 88=1,05966, 440=0,86700, 946=0,77067, 4906=0,67434, 9812=0,64062 (USD); ComponentLink1URL: https://cdn.amphenol-icc.com/media/wysiwyg/files/drawing/20021511.pdf?src-supplier=Digi-Key; ComponentLink1Description: https://cdn.amphenol-icc.com/media/wysiwyg/files/drawing/20021511.pdf?src-supplier=Digi-Key
CN3 = CONN-1x3pin: Connector 1x3; Manufacturer: *; Manufacturer Part Number: *; Supplier 1: Digi-Key; Supplier Part Number 1: *
D2 = IN-S85DATRG: SMD LED 0805 Red, Green; Manufacturer: Inolux; Description 1: Led Green/red Clear 0805 SMD; Color: Green,Red; Lens Color: Clear; Lens Style: Flat; Luminous Intensity: 140mcd; Forward Voltage: 2.2V; Test Current: 20mA; Viewing Angle: 120°; Dominant Wavelength: 522nm; Lens Size: 1.25mm; Supplier 1: Digi-Key; Supplier Part Number 1: 1830-1085-1-ND; Manufacturer Part Number: IN-S85DATRG; RoHS: No; Stock 1: 72542; Pricing 1: 1=0,43000, 10=0,28100, 100=0,18760, 500=0,12974, 1000=0,10812 (USD); Mount: Surface Mount; Case/Package: 0805; Packaging: Tape and Reel; Lens Transparency: Clear; Length: 2mm; Width: 1.25mm; Height: 1.1mm; ComponentLink1URL: http://www.inolux-corp.com/datasheet/SMDLED/Bi-Color%20Top%20View/IN-S85DATRG_V1.0.pdf?src-supplier=Digi-Key; ComponentLink1Description: http://www.inolux-corp.com/datasheet/SMDLED/Bi-Color%20Top%20View/IN-S85DATRG_V1.0.pdf?src-supplier=Digi-Key
L3 = Inductor: DigiKey: *
R7-R16 = res: Manufacturer: Panasonic; Manufacturer Part Number: ERJ-3EKF1002V; Description 1: PANASONIC - ERJ-3EKF1002V. - THICK FILM CHIP RES, 0603, 1%, PRECISION; Resistance: 10kR; Power Rating: 100mW; Tolerance: 1%; Voltage Rating: 75V; Temperature Coefficient: 100ppm/°C; ComponentLink1URL: http://www.vishay.com/docs/28773/crcwce3.pdf?src-supplier=Digi-Key; ComponentLink1Description: http://www.vishay.com/docs/28773/crcwce3.pdf?src-supplier=Digi-Key; ComponentLink2URL: http://components.arrow.com/part/dataview/3984768S7115702N1386?src-supplier=Arrow+Electronics; ComponentLink2Description: http://components.arrow.com/part/dataview/3984768S7115702N1386?src-supplier=Arrow+Electronics; ComponentLink3URL: http://components.arrow.com/part/dataview/0323_02069964?src-supplier=Arrow+Europe; ComponentLink3Description: http://components.arrow.com/part/dataview/0323_02069964?src-supplier=Arrow+Europe; ComponentLink4URL: http://www.jameco.com/Jameco/Products/ProdDS/1987468.pdf?src-supplier=Jameco; ComponentLink4Description: http://www.jameco.com/Jameco/Products/ProdDS/1987468.pdf?src-supplier=Jameco; ComponentLink5URL: http://industrial.panasonic.com/cdbs/www-data/pdf/RDA0000/AOA0000C304.pdf?src-supplier=Farnell; ComponentLink5Description: http://industrial.panasonic.com/cdbs/www-data/pdf/RDA0000/AOA0000C304.pdf?src-supplier=Farnell; ComponentLink6URL: https://industrial.panasonic.com/cdbs/www-data/pdf/RDA0000/DMA0000COL11.pdf?src-supplier=Allied+Electronics; ComponentLink6Description: https://industrial.panasonic.com/cdbs/www-data/pdf/RDA0000/DMA0000COL11.pdf?src-supplier=Allied+Electronics; ComponentLink7URL: https://industrial.panasonic.com/cdbs/www-data/pdf/RDA0000/DMA0000COL11.pdf?src-supplier=RSComponents; ComponentLink7Description: https://industrial.panasonic.com/cdbs/www-data/pdf/RDA0000/DMA0000COL11.pdf?src-supplier=RSComponents; ComponentLink8URL: http://www.farnell.com/datasheets/1911175.pdf?src-supplier=Element14; ComponentLink8Description: http://www.farnell.com/datasheets/1911175.pdf?src-supplier=Element14; Supplier 1: Digi-Key; Supplier Part Number 1: P10.0KHCT-ND; RoHS: Yes; Category: Chip SMD Resistors; Stock 1: 7629588; Pricing 1: 1=0,10000, 10=0,03700, 100=0,01490, 1000=0,00670, 2500=0,00582 (USD); Mount: Surface Mount; Case/Package: 0603; Number of Pins: 2; Case Code (Metric): 1608; Case Code (Imperial): 0603; Contact Plating: Tin; Size Code: 0603; Min Operating Temperature: -55°C; Max Operating Temperature: 155°C; Packaging: Tape and Reel; Package Quantity: 1; Resistor Type: Thick Film; Number of Terminations: 2; Termination: SMD/SMT; Max Power Dissipation: 100mW; Voltage Rating (DC): 75V; Features: Automotive AEC-Q200; Series: ERJ; Resistance Tolerance: 1%; Construction: Rectangular; Technology: THICK FILM; Length: 1.6mm; Width: 0.031inch; Height: 0.45mm; Depth: 0.8mm; Radiation Hardening: No; REACH SVHC: No SVHC; Military Standard: Not; Lead Free: Lead Free; RoHS Compliant: Yes
S2 S3 S5 = SW-PB: Switch; Manufacturer: *; Manufacturer Part Number: *; Supplier 1: Digi-Key; Supplier Part Number 1: *
U1 = CC1352R: Mfr_Name: Texas Instruments; Manufacturer_Part_Number: CC1352P1F3RGZT; Type: DEV; RefDes: RefDes; Copyright: Copyright (C) 2022 Ultra Librarian. All rights reserved.; Digi-Key_Part_Number_1: 296-53598-1-ND; Digi-Key_Part_Number_2: 296-53598-2-ND; Digi-Key_Part_Number_3: 296-53598-6-ND
Y1 Y2 = XTAL_4pin: Crystal Oscillator; DigiKey: *